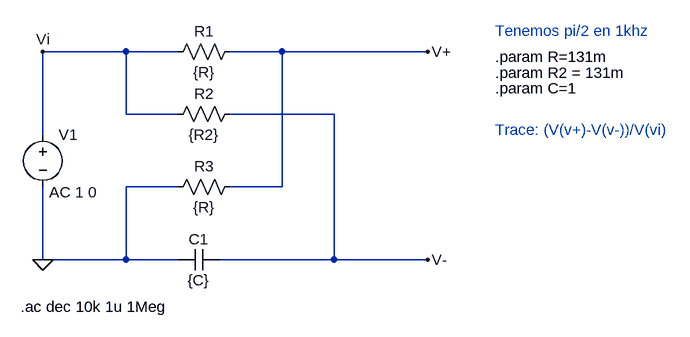
[diagram p0: schematic Lattice.asc]
Lattice.asc, the LTspice schematic file:
Version 4
SHEET 1 1008 680
WIRE 128 0 0 0
WIRE 208 0 128 0
WIRE 368 0 288 0
WIRE 592 0 368 0
WIRE 128 96 128 0
WIRE 208 96 128 96
WIRE 448 96 288 96
WIRE 0 128 0 0
WIRE 208 208 128 208
WIRE 368 208 368 0
WIRE 368 208 288 208
WIRE 0 320 0 208
WIRE 128 320 128 208
WIRE 128 320 0 320
WIRE 208 320 128 320
WIRE 448 320 448 96
WIRE 448 320 272 320
WIRE 592 320 448 320
FLAG 0 320 0
FLAG 0 0 Vi
FLAG 592 0 V+
FLAG 592 320 V-
SYMBOL voltage 0 112 R0
WINDOW 123 10 104 Left 2
WINDOW 39 0 0 Left 0
SYMATTR InstName V1
SYMATTR Value ""
SYMATTR Value2 AC 1 0
SYMBOL res 304 -16 R90
WINDOW 0 0 56 VBottom 2
WINDOW 3 32 56 VTop 2
SYMATTR InstName R1
SYMATTR Value {R}
SYMBOL res 304 80 R90
WINDOW 0 0 56 VBottom 2
WINDOW 3 32 56 VTop 2
SYMATTR InstName R2
SYMATTR Value {R2}
SYMBOL res 304 192 R90
WINDOW 0 0 56 VBottom 2
WINDOW 3 32 56 VTop 2
SYMATTR InstName R3
SYMATTR Value {R}
SYMBOL cap 272 304 R90
WINDOW 0 0 32 VBottom 2
WINDOW 3 32 32 VTop 2
SYMATTR InstName C1
SYMATTR Value {C}
TEXT 696 8 Left 2 !.param R=131m
TEXT 696 32 Left 2 !.param R2 = 131m
TEXT 696 56 Left 2 !.param C=1
TEXT -34 392 Left 2 !.ac dec 10k 1u 1Meg
TEXT 696 120 Left 2 ;Trace: (V(v+)-V(v-))/V(vi)
TEXT 696 -32 Left 2 ;Tenemos pi/2 en 1khz

The netlist it stands for:
* Lattice.asc
V1 Vi 0 AC 1 0
R1 V+ Vi {R}
R2 V- Vi {R2}
R3 V+ 0 {R}
C1 V- 0 {C}
.param R=131m
.param R2 = 131m
.param C=1
.ac dec 10k 1u 1Meg
* Trace: (V(v+)-V(v-))/V(vi)
* Tenemos pi/2 en 1khz
.backanno
.end